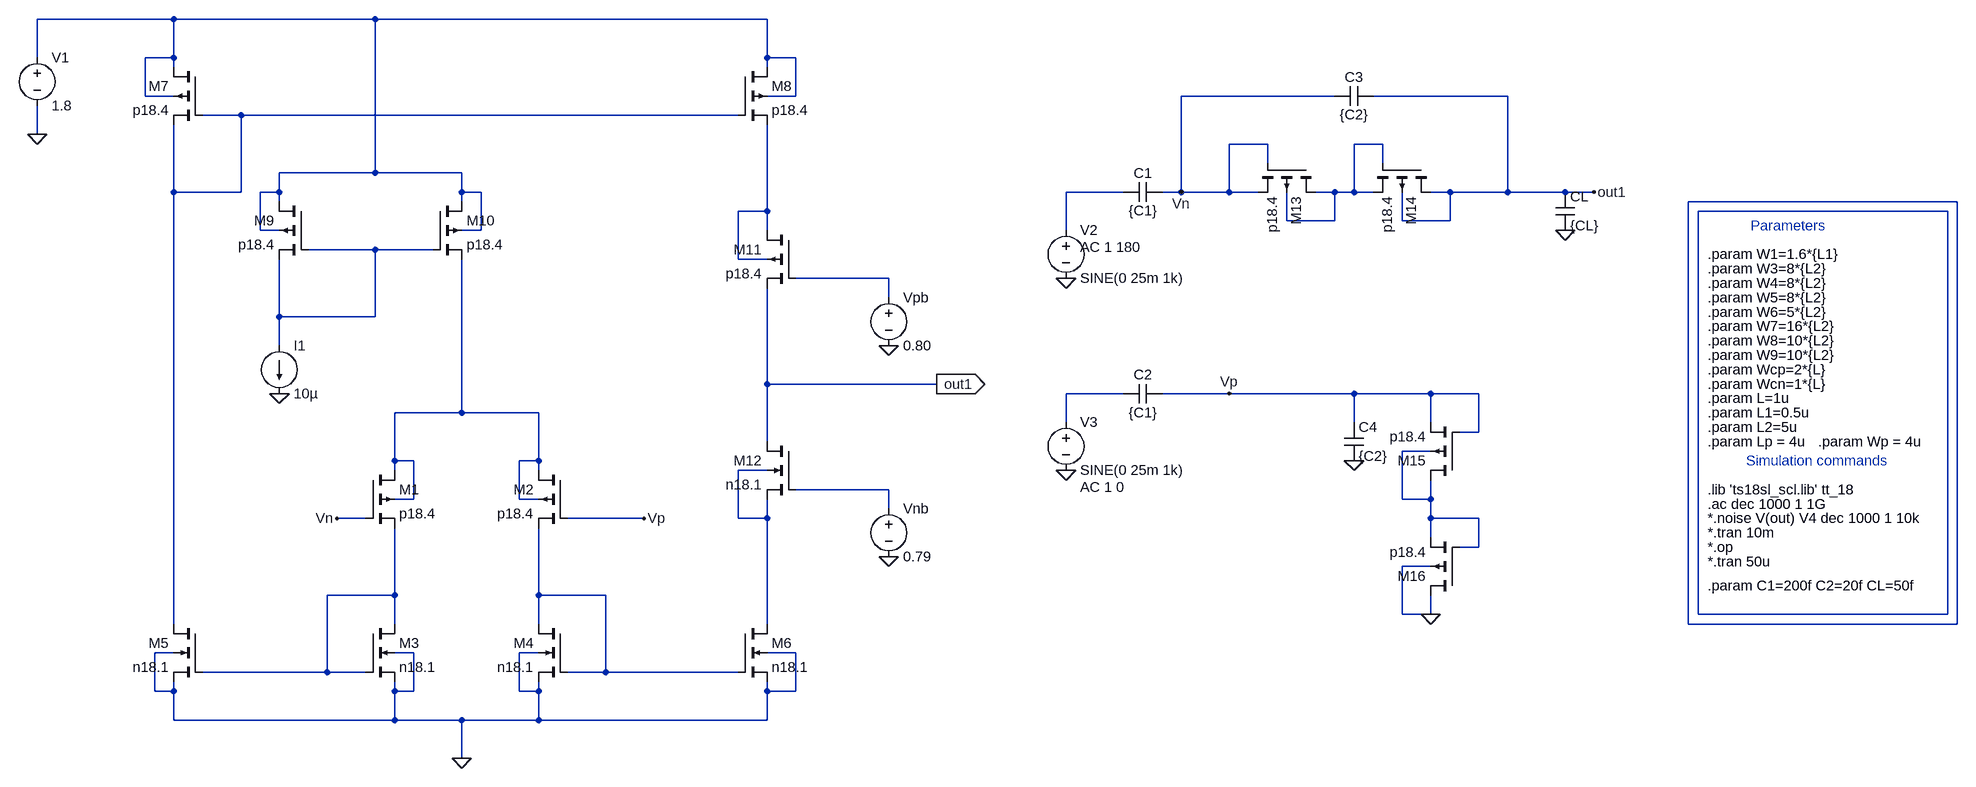
[diagram p0: schematic neural.asc]
neural.asc, the LTspice schematic file:
Version 4
SHEET 1 3284 1048
WIRE -224 -624 -480 -624
WIRE 112 -624 -224 -624
WIRE 848 -624 112 -624
WIRE -480 -560 -480 -624
WIRE -224 -560 -224 -624
WIRE -224 -560 -272 -560
WIRE 848 -560 848 -624
WIRE 896 -560 848 -560
WIRE -224 -544 -224 -560
WIRE 848 -544 848 -560
WIRE -272 -496 -272 -560
WIRE -224 -496 -272 -496
WIRE 896 -496 896 -560
WIRE 896 -496 848 -496
WIRE 1856 -496 1600 -496
WIRE 2144 -496 1920 -496
WIRE -112 -464 -176 -464
WIRE 800 -464 -112 -464
WIRE -480 -432 -480 -480
WIRE 1744 -416 1680 -416
WIRE 1936 -416 1888 -416
WIRE 1744 -384 1744 -416
WIRE 1936 -384 1936 -416
WIRE 112 -368 112 -624
WIRE 112 -368 -48 -368
WIRE 256 -368 112 -368
WIRE -224 -336 -224 -448
WIRE -112 -336 -112 -464
WIRE -112 -336 -224 -336
WIRE -48 -336 -48 -368
WIRE -48 -336 -80 -336
WIRE 256 -336 256 -368
WIRE 288 -336 256 -336
WIRE 1504 -336 1408 -336
WIRE 1600 -336 1600 -496
WIRE 1600 -336 1568 -336
WIRE 1680 -336 1680 -416
WIRE 1680 -336 1600 -336
WIRE 1728 -336 1680 -336
WIRE 1856 -336 1824 -336
WIRE 1888 -336 1888 -416
WIRE 1888 -336 1856 -336
WIRE 1920 -336 1888 -336
WIRE 2048 -336 2016 -336
WIRE 2144 -336 2144 -496
WIRE 2144 -336 2048 -336
WIRE 2240 -336 2144 -336
WIRE 2288 -336 2240 -336
WIRE -48 -320 -48 -336
WIRE 256 -320 256 -336
WIRE 3280 -320 2832 -320
WIRE 848 -304 848 -448
WIRE 848 -304 800 -304
WIRE 3264 -304 2848 -304
WIRE 1776 -288 1776 -336
WIRE 1856 -288 1856 -336
WIRE 1856 -288 1776 -288
WIRE 1968 -288 1968 -336
WIRE 2048 -288 2048 -336
WIRE 2048 -288 1968 -288
WIRE -80 -272 -80 -336
WIRE -48 -272 -80 -272
WIRE 288 -272 288 -336
WIRE 288 -272 256 -272
WIRE 848 -272 848 -304
WIRE 1408 -272 1408 -336
WIRE 112 -240 0 -240
WIRE 208 -240 112 -240
WIRE 800 -224 800 -304
WIRE 848 -224 800 -224
WIRE 1056 -192 896 -192
WIRE 1056 -160 1056 -192
WIRE -48 -128 -48 -224
WIRE 112 -128 112 -240
WIRE 112 -128 -48 -128
WIRE -48 -80 -48 -128
WIRE 848 -16 848 -176
WIRE 1136 -16 848 -16
WIRE 1504 0 1408 0
WIRE 1680 0 1568 0
WIRE 1888 0 1680 0
WIRE 2016 0 1888 0
WIRE 2096 0 2016 0
WIRE 256 32 256 -224
WIRE 256 32 144 32
WIRE 384 32 256 32
WIRE 1408 48 1408 0
WIRE 1888 48 1888 0
WIRE 2016 48 2016 0
WIRE 2096 64 2096 0
WIRE 2096 64 2064 64
WIRE 848 80 848 -16
WIRE 2016 96 1968 96
WIRE 144 112 144 32
WIRE 176 112 144 112
WIRE 384 112 384 32
WIRE 384 112 352 112
WIRE 144 128 144 112
WIRE 384 128 384 112
WIRE 848 128 800 128
WIRE 1056 160 896 160
WIRE 176 176 176 112
WIRE 176 176 144 176
WIRE 352 176 352 112
WIRE 384 176 352 176
WIRE 1968 176 1968 96
WIRE 2016 176 2016 144
WIRE 2016 176 1968 176
WIRE 1056 192 1056 160
WIRE 96 208 48 208
WIRE 560 208 432 208
WIRE 800 208 800 128
WIRE 848 208 848 176
WIRE 848 208 800 208
WIRE 2016 208 2016 176
WIRE 2096 208 2016 208
WIRE 2016 240 2016 208
WIRE 2096 256 2096 208
WIRE 2096 256 2064 256
WIRE 2016 288 1968 288
WIRE 144 336 144 224
WIRE 144 336 32 336
WIRE 384 336 384 224
WIRE 496 336 384 336
WIRE 1968 368 1968 288
WIRE 2016 368 2016 336
WIRE 2016 368 1968 368
WIRE 2848 368 2848 -304
WIRE 3264 368 3264 -304
WIRE 3264 368 2848 368
WIRE -224 384 -224 -336
WIRE 144 384 144 336
WIRE 384 384 384 336
WIRE 848 384 848 208
WIRE 2832 384 2832 -320
WIRE 3280 384 3280 -320
WIRE 3280 384 2832 384
WIRE -224 432 -256 432
WIRE 176 432 144 432
WIRE 384 432 352 432
WIRE 896 432 848 432
WIRE 32 464 32 336
WIRE 32 464 -176 464
WIRE 96 464 32 464
WIRE 496 464 496 336
WIRE 496 464 432 464
WIRE 800 464 496 464
WIRE -256 496 -256 432
WIRE -224 496 -224 480
WIRE -224 496 -256 496
WIRE 144 496 144 480
WIRE 176 496 176 432
WIRE 176 496 144 496
WIRE 352 496 352 432
WIRE 384 496 384 480
WIRE 384 496 352 496
WIRE 848 496 848 480
WIRE 896 496 896 432
WIRE 896 496 848 496
WIRE -224 544 -224 496
WIRE 144 544 144 496
WIRE 144 544 -224 544
WIRE 256 544 144 544
WIRE 384 544 384 496
WIRE 384 544 256 544
WIRE 848 544 848 496
WIRE 848 544 384 544
WIRE 256 608 256 544
FLAG -48 0 0
FLAG 256 608 0
FLAG -480 -432 0
FLAG 1056 -80 0
FLAG 1056 272 0
FLAG 1136 -16 out1
IOPIN 1136 -16 Out
FLAG 48 208 Vn
FLAG 560 208 Vp
FLAG 1408 -192 0
FLAG 1408 128 0
FLAG 2288 -336 out1
FLAG 1600 -336 Vn
FLAG 2240 -272 0
FLAG 1888 112 0
FLAG 2016 368 0
FLAG 1680 0 Vp
DATAFLAG 256 32 ""
DATAFLAG 256 32 ""
DATAFLAG 848 -304 ""
DATAFLAG 848 256 ""
DATAFLAG 848 256 ""
DATAFLAG -48 -128 ""
DATAFLAG -224 240 ""
DATAFLAG -112 464 ""
DATAFLAG 352 -464 ""
DATAFLAG 848 -16 ""
DATAFLAG 848 -16 ""
DATAFLAG 384 336 ""
DATAFLAG 384 336 ""
DATAFLAG 1856 -336 ""
DATAFLAG 2048 -336 ""
DATAFLAG 2016 176 ""
DATAFLAG 2016 368 ""
SYMBOL pmos4 96 128 R0
SYMATTR InstName M1
SYMATTR Value p18.4
SYMATTR Value2 l={L1} w={W1} ad={5*{W1}*{L1/2}} as={5*{W1}*{L1/2}} pd={5*{L1} + 2*{W1}} ps={5*{L1} + 2*{W1}}
SYMBOL nmos4 96 384 R0
SYMATTR InstName M3
SYMATTR Value n18.1
SYMATTR Value2 l={L2} w={W3} ad={5*{W3}*{L2/2}} as={5*{W3}*{L2/2}} pd={5*{L2} + 2*{W3}} ps={5*{L2} + 2*{W3}}
SYMBOL nmos4 800 384 R0
SYMATTR InstName M6
SYMATTR Value n18.1
SYMATTR Value2 l={L2} w={W6} ad={5*{W6}*{L2/2}} as={5*{W6}*{L2/2}} pd={5*{L2} + 2*{W6}} ps={5*{L2} + 2*{W6}}
SYMBOL pmos4 800 -544 R0
SYMATTR InstName M8
SYMATTR Value p18.4
SYMATTR Value2 l={L2} w={W8} ad={5*{W8}*{L2/2}} as={5*{W8}*{L2/2}} pd={5*{L2} + 2*{W8}} ps={5*{L2} + 2*{W8}}
SYMBOL pmos4 208 -320 R0
SYMATTR InstName M10
SYMATTR Value p18.4
SYMATTR Value2 l={L2} w={W9} ad={5*{W9}*{L2/2}} as={5*{W9}*{L2/2}} pd={5*{L2} + 2*{W9}} ps={5*{L2} + 2*{W9}}
SYMBOL current -48 -80 R0
WINDOW 123 0 0 Left 0
WINDOW 39 0 0 Left 0
SYMATTR InstName I1
SYMATTR Value 10µ
SYMBOL voltage -480 -576 R0
WINDOW 123 24 44 Left 2
WINDOW 39 0 0 Left 0
SYMATTR InstName V1
SYMATTR Value 1.8
SYMBOL voltage 1056 176 R0
WINDOW 123 0 0 Left 0
WINDOW 39 0 0 Left 0
SYMATTR InstName Vnb
SYMATTR Value 0.79
SYMBOL voltage 1056 -176 R0
WINDOW 123 0 0 Left 0
WINDOW 39 0 0 Left 0
SYMATTR InstName Vpb
SYMATTR Value 0.80
SYMBOL pmos4 0 -320 M0
SYMATTR InstName M9
SYMATTR Value p18.4
SYMATTR Value2 l={L2} w={W9} ad={5*{W9}*{L2/2}} as={5*{W9}*{L2/2}} pd={5*{L2} + 2*{W9}} ps={5*{L2} + 2*{W9}}
SYMBOL pmos4 -176 -544 M0
SYMATTR InstName M7
SYMATTR Value p18.4
SYMATTR Value2 l={L2} w={W7} ad={5*{W7}*{L2/2}} as={5*{W7}*{L2/2}} pd={5*{L2} + 2*{W7}} ps={5*{L2} + 2*{W7}}
SYMBOL nmos4 -176 384 M0
SYMATTR InstName M5
SYMATTR Value n18.1
SYMATTR Value2 l={L2} w={W5} ad={5*{W5}*{L2/2}} as={5*{W5}*{L2/2}} pd={5*{L2} + 2*{W5}} ps={5*{L2} + 2*{W5}}
SYMBOL nmos4 432 384 M0
SYMATTR InstName M4
SYMATTR Value n18.1
SYMATTR Value2 l={L2} w={W4} ad={5*{W4}*{L2/2}} as={5*{W4}*{L2/2}} pd={5*{L2} + 2*{W4}} ps={5*{L2} + 2*{W4}}
SYMBOL pmos4 432 128 M0
SYMATTR InstName M2
SYMATTR Value p18.4
SYMATTR Value2 l={L1} w={W1} ad={5*{W1}*{L1/2}} as={5*{W1}*{L1/2}} pd={5*{L1} + 2*{W1}} ps={5*{L1} + 2*{W1}}
SYMBOL pmos4 896 -272 M0
SYMATTR InstName M11
SYMATTR Value p18.4
SYMATTR Value2 l={L} w={Wcp} ad={5*{Wcp}*{L/2}} as={5*{Wcp}*{L/2}} pd={5*{L} + 2*{Wcp}} ps={5*{L} + 2*{Wcp}}
SYMBOL nmos4 896 80 M0
SYMATTR InstName M12
SYMATTR Value n18.1
SYMATTR Value2 l={L} w={Wcn} ad={5*{Wcn}*{L/2}} as={5*{Wcn}*{L/2}} pd={5*{L} + 2*{Wcn}} ps={5*{L} + 2*{Wcn}}
SYMBOL voltage 1408 -288 R0
WINDOW 123 24 44 Left 2
WINDOW 39 0 0 Left 0
SYMATTR Value2 AC 1 180
SYMATTR InstName V2
SYMATTR Value SINE(0 25m 1k)
SYMBOL voltage 1408 32 R0
WINDOW 123 24 124 Left 2
WINDOW 39 0 0 Left 0
SYMATTR Value2 AC 1 0
SYMATTR InstName V3
SYMATTR Value SINE(0 25m 1k)
SYMBOL cap 1568 -352 R90
WINDOW 0 0 32 VBottom 2
WINDOW 3 32 32 VTop 2
SYMATTR InstName C1
SYMATTR Value {C1}
SYMBOL cap 1568 -16 R90
WINDOW 0 0 32 VBottom 2
WINDOW 3 32 32 VTop 2
SYMATTR InstName C2
SYMATTR Value {C1}
SYMBOL pmos4 1824 -384 R90
SYMATTR InstName M13
SYMATTR Value p18.4
SYMATTR Value2 l={Lp} w={Wp} ad={5*{Wp}*{Lp/2}} as={5*{Wp}*{Lp/2}} pd={5*{Lp} + 2*{Wp}} ps={5*{Lp} + 2*{Wp}}
SYMBOL pmos4 2016 -384 R90
SYMATTR InstName M14
SYMATTR Value p18.4
SYMATTR Value2 l={Lp} w={Wp} ad={5*{Wp}*{Lp/2}} as={5*{Wp}*{Lp/2}} pd={5*{Lp} + 2*{Wp}} ps={5*{Lp} + 2*{Wp}}
SYMBOL cap 1920 -512 R90
WINDOW 0 0 32 VBottom 2
WINDOW 3 32 32 VTop 2
SYMATTR InstName C3
SYMATTR Value {C2}
SYMBOL cap 2224 -336 R0
SYMATTR InstName CL
SYMATTR Value {CL}
SYMBOL cap 1872 48 R0
SYMATTR InstName C4
SYMATTR Value {C2}
SYMBOL pmos4 2064 144 R180
SYMATTR InstName M15
SYMATTR Value p18.4
SYMATTR Value2 l={Lp} w={Wp} ad={5*{Wp}*{Lp/2}} as={5*{Wp}*{Lp/2}} pd={5*{Lp} + 2*{Wp}} ps={5*{Lp} + 2*{Wp}}
SYMBOL pmos4 2064 336 R180
SYMATTR InstName M16
SYMATTR Value p18.4
SYMATTR Value2 l={Lp} w={Wp} ad={5*{Wp}*{Lp/2}} as={5*{Wp}*{Lp/2}} pd={5*{Lp} + 2*{Wp}} ps={5*{Lp} + 2*{Wp}}
TEXT 2864 8 Left 2 !.param L=1u
TEXT 2864 -112 Left 2 !.param W7=16*{L2}
TEXT 2864 -160 Left 2 !.param W5=8*{L2}
TEXT 2864 -208 Left 2 !.param W3=8*{L2}
TEXT 2864 -88 Left 2 !.param W8=10*{L2}
TEXT 2864 -136 Left 2 !.param W6=5*{L2}
TEXT 2864 -184 Left 2 !.param W4=8*{L2}
TEXT 2864 -232 Left 2 !.param W1=1.6*{L1}
TEXT 2864 -64 Left 2 !.param W9=10*{L2}
TEXT 2864 160 Left 2 !.lib 'ts18sl_scl.lib' tt_18
TEXT 2864 184 Left 2 !.ac dec 1000 1 1G
TEXT 2864 32 Left 2 !.param L1=0.5u
TEXT 2864 56 Left 2 !.param L2=5u
TEXT 2864 -16 Left 2 !.param Wcn=1*{L}
TEXT 2864 -40 Left 2 !.param Wcp=2*{L}
TEXT 2864 208 Left 2 !*.noise V(out) V4 dec 1000 1 10k
TEXT 2864 232 Left 2 !*.tran 10m
TEXT 2864 256 Left 2 !*.op
TEXT 2936 -280 Left 2 ;Parameters
TEXT 2928 112 Left 2 ;Simulation commands
TEXT 2864 280 Left 2 !*.tran 50u
TEXT 2864 80 Left 2 !.param Lp = 4u
TEXT 3048 80 Left 2 !.param Wp = 4u
TEXT 2864 320 Left 2 !.param C1=200f C2=20f CL=50f

The netlist it stands for:
* neural.asc
M1 N011 Vn N015 N011 p18.4 l={L1} w={W1} ad={5*{W1}*{L1/2}} as={5*{W1}*{L1/2}} pd={5*{L1} + 2*{W1}} ps={5*{L1} + 2*{W1}}
M3 N015 N015 0 0 n18.1 l={L2} w={W3} ad={5*{W3}*{L2/2}} as={5*{W3}*{L2/2}} pd={5*{L2} + 2*{W3}} ps={5*{L2} + 2*{W3}}
M6 N013 N016 0 0 n18.1 l={L2} w={W6} ad={5*{W6}*{L2/2}} as={5*{W6}*{L2/2}} pd={5*{L2} + 2*{W6}} ps={5*{L2} + 2*{W6}}
M8 N001 N002 N006 N001 p18.4 l={L2} w={W8} ad={5*{W8}*{L2/2}} as={5*{W8}*{L2/2}} pd={5*{L2} + 2*{W8}} ps={5*{L2} + 2*{W8}}
M10 N001 N008 N011 N001 p18.4 l={L2} w={W9} ad={5*{W9}*{L2/2}} as={5*{W9}*{L2/2}} pd={5*{L2} + 2*{W9}} ps={5*{L2} + 2*{W9}}
I1 N008 0 10µ
V1 N001 0 1.8
Vnb N014 0 0.79
Vpb N009 0 0.80
M9 N001 N008 N008 N001 p18.4 l={L2} w={W9} ad={5*{W9}*{L2/2}} as={5*{W9}*{L2/2}} pd={5*{L2} + 2*{W9}} ps={5*{L2} + 2*{W9}}
M7 N001 N002 N002 N001 p18.4 l={L2} w={W7} ad={5*{W7}*{L2/2}} as={5*{W7}*{L2/2}} pd={5*{L2} + 2*{W7}} ps={5*{L2} + 2*{W7}}
M5 N002 N015 0 0 n18.1 l={L2} w={W5} ad={5*{W5}*{L2/2}} as={5*{W5}*{L2/2}} pd={5*{L2} + 2*{W5}} ps={5*{L2} + 2*{W5}}
M4 N016 N016 0 0 n18.1 l={L2} w={W4} ad={5*{W4}*{L2/2}} as={5*{W4}*{L2/2}} pd={5*{L2} + 2*{W4}} ps={5*{L2} + 2*{W4}}
M2 N011 Vp N016 N011 p18.4 l={L1} w={W1} ad={5*{W1}*{L1/2}} as={5*{W1}*{L1/2}} pd={5*{L1} + 2*{W1}} ps={5*{L1} + 2*{W1}}
M11 N006 N009 out1 N006 p18.4 l={L} w={Wcp} ad={5*{Wcp}*{L/2}} as={5*{Wcp}*{L/2}} pd={5*{L} + 2*{Wcp}} ps={5*{L} + 2*{Wcp}}
M12 out1 N014 N013 N013 n18.1 l={L} w={Wcn} ad={5*{Wcn}*{L/2}} as={5*{Wcn}*{L/2}} pd={5*{L} + 2*{Wcn}} ps={5*{L} + 2*{Wcn}}
V2 N004 0 SINE(0 25m 1k) AC 1 180
V3 N010 0 SINE(0 25m 1k) AC 1 0
C1 Vn N004 {C1}
C2 Vp N010 {C1}
M13 N003 Vn Vn N003 p18.4 l={Lp} w={Wp} ad={5*{Wp}*{Lp/2}} as={5*{Wp}*{Lp/2}} pd={5*{Lp} + 2*{Wp}} ps={5*{Lp} + 2*{Wp}}
M14 out1 N003 N003 out1 p18.4 l={Lp} w={Wp} ad={5*{Wp}*{Lp/2}} as={5*{Wp}*{Lp/2}} pd={5*{Lp} + 2*{Wp}} ps={5*{Lp} + 2*{Wp}}
C3 out1 Vn {C2}
CL out1 0 {CL}
C4 Vp 0 {C2}
M15 N012 Vp Vp N012 p18.4 l={Lp} w={Wp} ad={5*{Wp}*{Lp/2}} as={5*{Wp}*{Lp/2}} pd={5*{Lp} + 2*{Wp}} ps={5*{Lp} + 2*{Wp}}
M16 0 N012 N012 0 p18.4 l={Lp} w={Wp} ad={5*{Wp}*{Lp/2}} as={5*{Wp}*{Lp/2}} pd={5*{Lp} + 2*{Wp}} ps={5*{Lp} + 2*{Wp}}
.model NMOS NMOS
.model PMOS PMOS
.lib standard.mos
.param L=1u
.param W7=16*{L2}
.param W5=8*{L2}
.param W3=8*{L2}
.param W8=10*{L2}
.param W6=5*{L2}
.param W4=8*{L2}
.param W1=1.6*{L1}
.param W9=10*{L2}
.lib 'ts18sl_scl.lib' tt_18
.ac dec 1000 1 1G
.param L1=0.5u
.param L2=5u
.param Wcn=1*{L}
.param Wcp=2*{L}
*.noise V(out) V4 dec 1000 1 10k
*.tran 10m
*.op
* Parameters
* Simulation commands
*.tran 50u
.param Lp = 4u
.param Wp = 4u
.param C1=200f C2=20f CL=50f
.backanno
.end